# Altium schematic sheet Aux_Supply.SchDoc
size A4; SheetNumber: 6; SheetTotal: 9
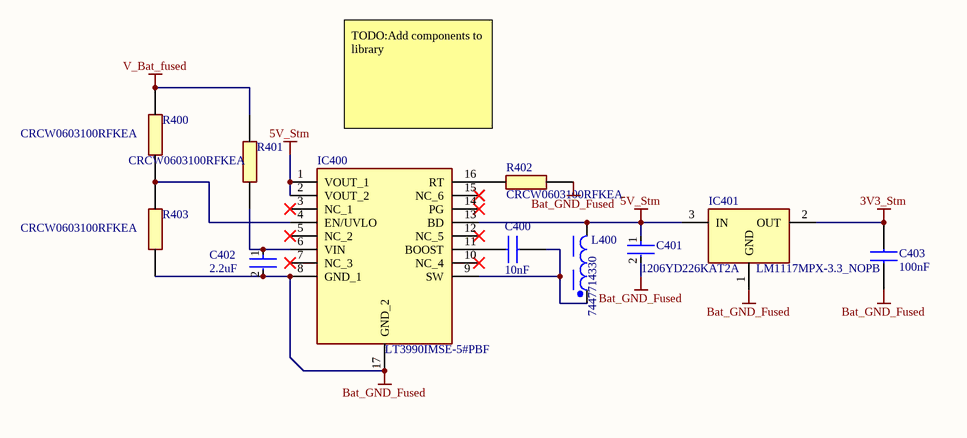
[diagram p0: Aux_Supply.SchDoc]

## Parts
C400  value 10nF  [CAPC1608X90N]  (hidden comment: 06031C103K4Z2A)
C401  1206YD226KAT2A  [FP-1206-L_3_2_0_2-W_1_6_0-IPC_C]
C402  Capacitance: 2.2uF  [FP-C3216-160-0_2-IPC_B]  (hidden comment: C3216X7S2A225K160AB)
C403  value 100nF  [CAPC1608X90N]  (hidden comment: 0603YG104ZAT2A)
IC400  LT3990IMSE-5#PBF  [SOP50P490X110-17N]
IC401  LM1117MPX-3.3_NOPB  [SOT230P700X180-4N]
L400  7447714330  [WE-PD_1050P]
R400  CRCW0603100RFKEA  [RESC1608X50N]
R401  CRCW0603100RFKEA  [RESC1608X50N]
R402  CRCW0603100RFKEA  [RESC1608X50N]
R403  CRCW0603100RFKEA  [RESC1608X50N]

## Nets
3V3_Stm: C403.2 IC401.2(OUT)
5V_Stm: C401.1 IC400.1(VOUT_1) IC400.2(VOUT_2) IC400.13(BD) IC401.3(IN) L400.2
Bat_GND_Fused: C401.2 C402.2 C403.1 IC400.8(GND_1) IC400.17(GND_2) IC401.1(GND) R402.2 R403.1
V_Bat_fused: R400.2 R401.1
NetC400_1: C400.1 IC400.9(SW) L400.1
NetC400_2: C400.2 IC400.11(BOOST)
NetC402_1: C402.1 IC400.6(VIN) R401.2
NetIC400_4: IC400.4(EN/UVLO) R400.1 R403.2
NetIC400_16: IC400.16(RT) R402.1

Not connected (* = marked no-connect by the designer): IC400 3(NC_1)* 5(NC_2)* 7(NC_3)* 10(NC_4)* 12(NC_5)* 14(PG)* 15(NC_6)*

## Notes on the sheet
- TODO:Add components to library

## Library data of the parts
C400 = 06031C103K4Z2A: Capacitor; Manufacturer_Name: Kyocera AVX; Datasheet Link: https://componentsearchengine.com/Datasheets/1/06031A100FAT2A.pdf; Height: 0.9mm; Manufacturer_Part_Number: 06031C103K4Z2A; Mouser Part Number: 581-06031C103K4Z2A; Mouser Price/Stock: https://www.mouser.com/Search/Refine.aspx?Keyword=581-06031C103K4Z2A; Arrow Part Number: 06031C103K4Z2A; Arrow Price/Stock: https://www.arrow.com/en/products/06031c103k4z2a/avx
C401 = CMP-1037-04992-2: General Purpose Ceramic Capacitor, 1206, 22uF, 10%, X5R, 15%, 16V; REACH SVHC: No SVHC; Height: 0.07mm; Lead Free: Lead Free; Voltage Rating: 16V; Width: 0.063inch; Voltage Rating (DC): 16V; Mount: Surface Mount; Capacitance: 22uF; Case Code (Imperial): 1206; Package Quantity: 1; Radiation Hardening: No; Packaging: Tape and Reel; Number of Pins: 2; Construction: Flat; Max Operating Temperature: 85°C; Depth: 1.6mm; Case Code (Metric): 3216; Thickness: 0.07inch; Min Operating Temperature: -55°C; Contact Plating: Tin; Dielectric: X5R; Case/Package: 1206; Series: -; Termination: SMD/SMT; Length: 3.2mm; RoHS Compliant: Yes; Tolerance: 10%
C402 = CMP-08246-004303-1: Multilayer Ceramic Capacitors 2.2uF ±10% 100V X7S SMD 1206; Min Operating Temperature: -55°C; Tolerance: 10%; Number of Pins: 2; Case Code (Metric): 3216; REACH SVHC: No SVHC; Package Quantity: 1; Lead Free: Lead Free; Termination: SMD/SMT; Voltage Rating (DC): 100V; Voltage Rating: 100V; Case Code (Imperial): 1206; Dielectric: X7S; Height: 1.6mm; Packaging: Tape and Reel; Weight: 0.000571oz; Radiation Hardening: No; Mount: Surface Mount; Width: 0.063inch; Length: 3.2mm; Case/Package: 1206; Depth: 1.6mm; RoHS Compliant: Yes; Max Operating Temperature: 125°C; Series: C; Voltage: 100V; Resistor Type: Ceramic; Thickness: 0.071inch; Construction: Flat
C403 = 0603YG104ZAT2A: Capacitor; Manufacturer_Name: Kyocera AVX; Datasheet Link: https://componentsearchengine.com/Datasheets/1/06031A100FAT2A.pdf; Height: 0.9mm; Manufacturer_Part_Number: 0603YG104ZAT2A; Mouser Part Number: 581-0603YG104ZAT2A; Mouser Price/Stock: https://www.mouser.co.uk/ProductDetail/AVX/0603YG104ZAT2A?qs=b9lrxWun4G3w2hKVYW6fsQ%3D%3D; Arrow Part Number: 0603YG104ZAT2A; Arrow Price/Stock: https://www.arrow.com/en/products/0603yg104zat2a/avx?region=nac
IC400 = LT3990IMSE-5#PBF: Integrated Circuit; Manufacturer_Name: Analog Devices; Datasheet Link: https://www.analog.com/LT3990/datasheet; Height: 1.1mm; Manufacturer_Part_Number: LT3990IMSE-5#PBF; Mouser Part Number: 584-LT3990IMSE-5#PBF; Mouser Price/Stock: https://www.mouser.co.uk/ProductDetail/Analog-Devices/LT3990IMSE-5PBF?qs=hVkxg5c3xu%252BVMOa5O8HlFw%3D%3D; Arrow Part Number: LT3990IMSE-5#PBF; Arrow Price/Stock: https://www.arrow.com/en/products/lt3990imse-5pbf/analog-devices?region=nac
IC401 = LM1117MPX-3.3_NOPB: Integrated Circuit; Manufacturer_Name: Texas Instruments; Manufacturer_Part_Number: LM1117MPX-3.3/NOPB; Datasheet Link: http://www.ti.com/lit/ds/symlink/lm1117.pdf; Height: 1.8mm; Mouser Part Number: 926-LM1117MPX3.3NOPB; Mouser Price/Stock: https://www.mouser.co.uk/ProductDetail/Texas-Instruments/LM1117MPX-3.3-NOPB?qs=X1J7HmVL2ZHRbBIxXi4utg%3D%3D; Arrow Part Number: LM1117MPX-3.3/NOPB; Arrow Price/Stock: https://www.arrow.com/en/products/lm1117mpx-3.3nopb/texas-instruments?utm_currency=USD&region=nac
L400 = CMP-1396-00022-2: NexarPartId: 22866944; Tolerance: 20%; Saturation Current: 2.9A; Resistance: 79mΩ; DC Resistance (DCR): 66mΩ; Shielding: Shielded; RMS Current (Irms): 2.5A; Test Frequency: 100kHz; Self Resonant Frequency: 11.1MHz; Inductance: 33µH; Core Material: Ferrite; Number of Pins: 2; Height: 5mm; Width: 10mm; Min Operating Temperature: -40°C; Inductance Tolerance: 20%; Termination: SMD/SMT; Depth: 10mm; Packaging: Cut Tape (CT); Ambient Temperature Range High: 110°C; Height - Seated (Max): 5.0038mm; Composition: Wirewound; Max Operating Temperature: 150°C; Max DC Current: 2.5A; REACH SVHC: Unknown; Current Rating: 2.5A; Series Resistance: 79mΩ; Case/Package: Nonstandard; Ambient Temperature Range Low: -40°C; RoHS: Compliant; Length: 10mm; Mount: Surface Mount
R400-R403 = CRCW0603100RFKEA: Resistor; Manufacturer_Name: Vishay; Datasheet Link: http://www.vishay.com/docs/20035/dcrcwe3.pdf; Height: 0.5mm; Manufacturer_Part_Number: CRCW0603100RFKEA; Mouser Part Number: 71-CRCW0603-100-E3; Mouser Price/Stock: https://www.mouser.co.uk/ProductDetail/Vishay-Dale/CRCW0603100RFKEA?qs=90AHS1y%2FsidGWjjxZAupKg%3D%3D; Arrow Part Number: CRCW0603100RFKEA; Arrow Price/Stock: https://www.arrow.com/en/products/crcw0603100rfkea/vishay?utm_currency=USD&region=europe